# Altium schematic sheet TopLevel.SchDoc
size A3; SheetNumber: 1; SheetTotal: 5
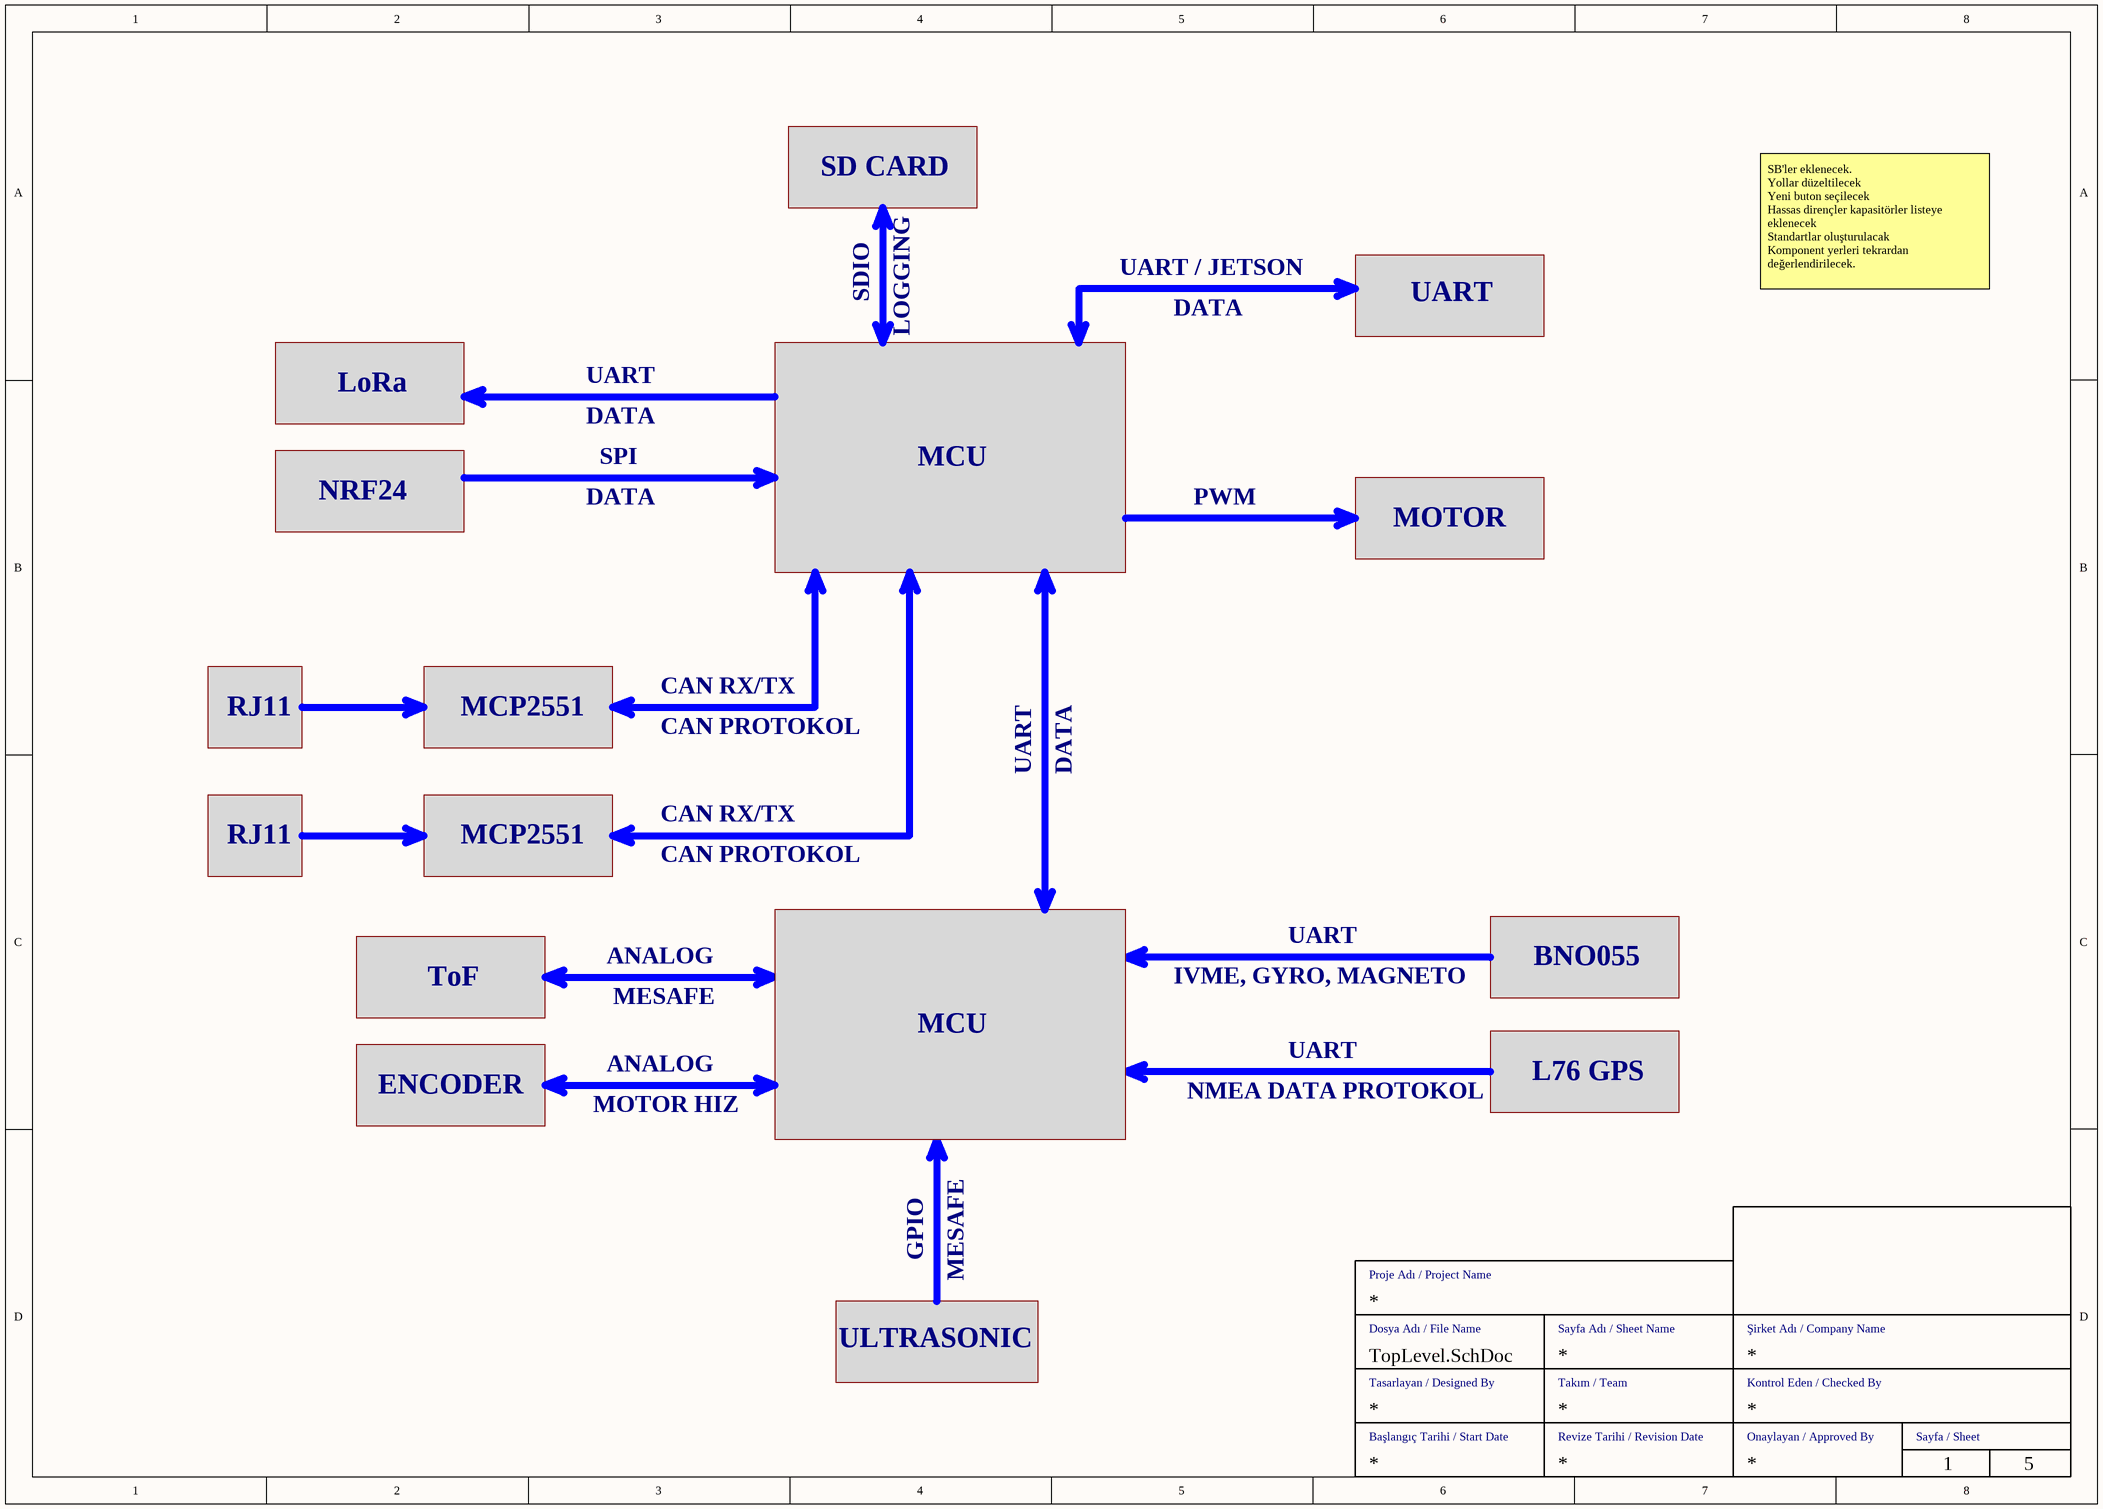
[diagram p0: TopLevel.SchDoc]

## Notes on the sheet
- SD CARD
- SDIO
- UART / JETSON
- DATA
- UART
- SB'ler eklenecek.
  Yollar düzeltilecek
  Yeni buton seçilecek
  Hassas dirençler kapasitörler listeye eklenecek
  Standartlar oluşturulacak
  Komponent yerleri tekrardan değerlendirilecek.
- LOGGING
- LoRa
- NRF24
- SPI
- MCU
- PWM
- MOTOR
- RJ11
- MCP2551
- CAN RX/TX
- CAN PROTOKOL
- ToF
- ANALOG
- IVME, GYRO, MAGNETO
- BNO055
- MESAFE
- ENCODER
- MOTOR HIZ
- NMEA DATA PROTOKOL
- L76 GPS
- GPIO
- ULTRASONIC
- Dosya Adı / File Name
- Proje Adı / Project Name
- Sayfa Adı / Sheet Name
- Şirket Adı / Company Name
- Tasarlayan / Designed By
- Takım / Team
- Kontrol Eden / Checked By
- Başlangıç Tarihi / Start Date
- Revize Tarihi / Revision Date
- Onaylayan / Approved By
- Sayfa / Sheet